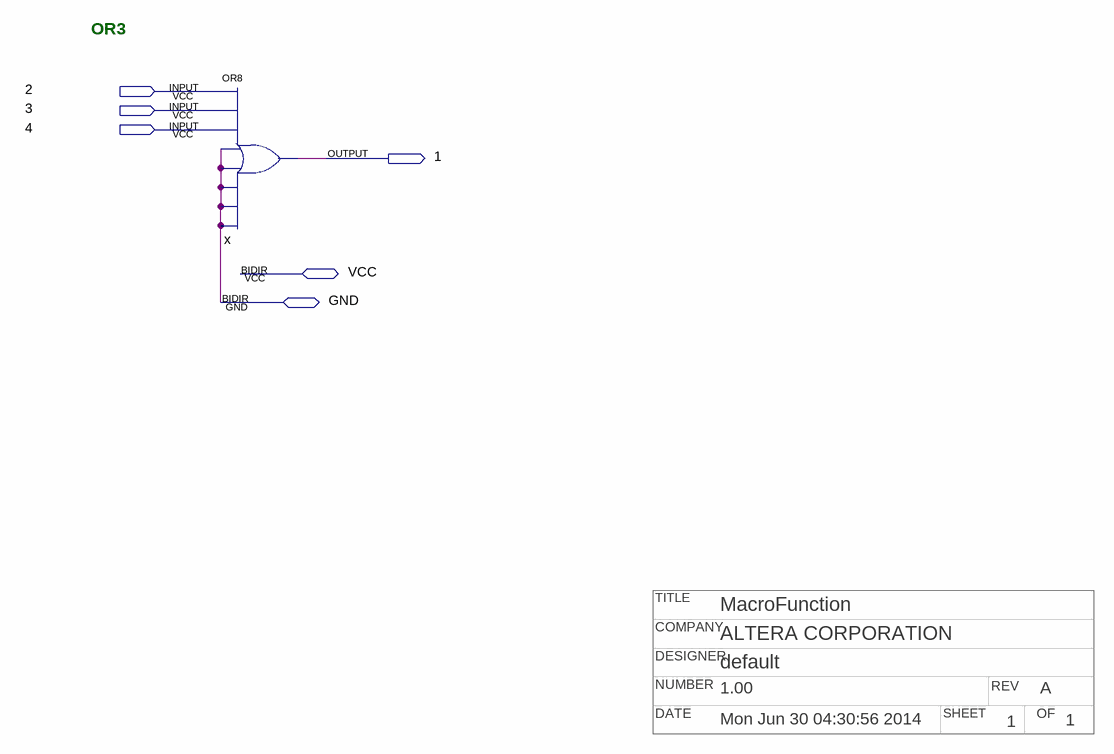
[diagram p0: schematic sheet]
// Quartus schematic npor3.bdf as structural Verilog: 1 symbols, 6 pins
// Title block: TITLE: MacroFunction; COMPANY: ALTERA CORPORATION; DESIGNER: default; NUMBER: 1.00; REV: A; DATE: Mon Jun 30 04:30:56 2014; SHEET: 1; OF: 1
module npor3 (
  input  \2 ,
  input  \3 ,
  input  \4 ,
  inout  VCC,
  inout  GND,
  output \1 
);

  or x (\1 , \2 , \3 , \4 , GND, GND, GND, GND, GND);

  // Notes on the sheet:
  //   OR3
endmodule
